# EAGLE design OSO-MISC-20-002 Analog Sensors (EAGLE 9.4.2)
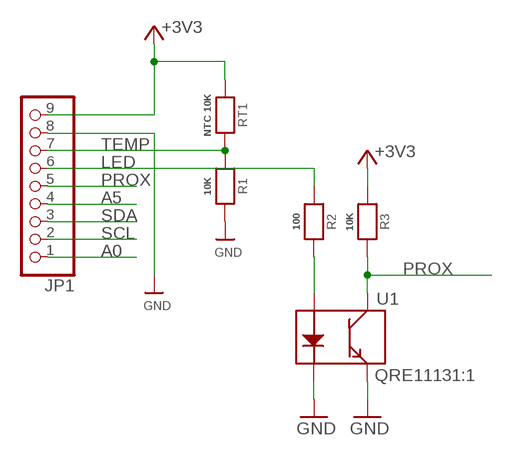
[diagram p0: schematic, sheet 1]

## Parts
JP1  HEADER-1X9_JSTSH  [JST_SH9]
R1  10K  RESISTOR0805_NOOUTLINE  [0805-NO]
R2  100  RESISTOR0805_NOOUTLINE  [0805-NO]
R3  10K  RESISTOR0805_NOOUTLINE  [0805-NO]
RT1  NTC 10K  RESISTOR0805_NOOUTLINE  [0805-NO]
U1  QRE11131:1  [QRE1113-1:1]

## Nets
+3V3: JP1.9 R3.1 RT1.1
A0: JP1.1
A5: JP1.4
GND [gnd]: JP1.8 R1.2 U1.2(K) U1.4(E)
LED: JP1.6 R2.1
N$1: R2.2 U1.1(A)
PROX: JP1.5 R3.2 U1.3(C)
SCL: JP1.2
SDA: JP1.3
TEMP: JP1.7 R1.1 RT1.2

## Library data of the parts
JP1 = microbuilder:HEADER-1X9: PIN HEADER
R1-R3 RT1 = microbuilder:RESISTOR: Resistors For new designs, use the packages preceded by an '_' character since they are more reliable: The following footprints should be used on most boards: _0402 - Standard footprint for regular board layouts _0603 - Standard footprint for regular board layouts _0805 - Standard footprint for regular board layouts _1206 - Standard footprint for regular board layouts For extremely tight-pitch boards where space is at a premium, the following 'micro-pitch' footprints can be used (smaller pads, no silkscreen outline, etc.): _0402MP - Micro-pitch footprint for very dense/compact boards _0603MP - Micro-pitch footprint for very dense/compact boards _0805MP - Micro-pitch footprint for very dense/compact boards _1206MP - Micro-pitch footprint for very dense/compact boards
U1 = Testing:QRE1113

## Net classes
0 default: width 0.152 mm, drill 0.254 mm

## Board
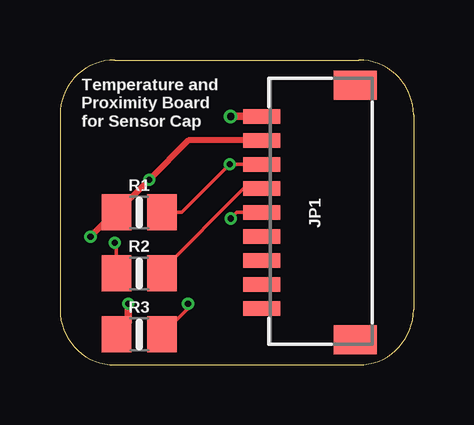
[diagram p1: board, top side]
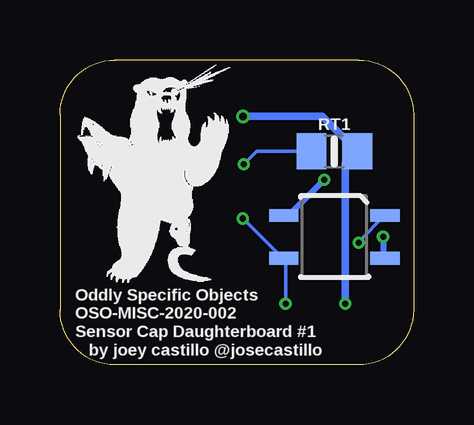
[diagram p2: board, bottom side, seen from below]

Size 14.73 x 12.7 mm. Coordinates in mm from the lower left corner, seen from the top.
Outline: 14.73,10.41 arc90 12.45,12.7 2.29,12.7 arc90 0,10.41 0,2.29 arc90 2.29,0 12.45,0 arc90 14.73,2.29 14.73,10.41
Copper layers (1*16): Top 0.035559375mm / dielectric 1.6mm / Bottom 0.035559375mm
Design rules "oshpark-2layer *": minimum track width 6mil, minimum drill 10mil, track to track 6mil, track to pad 6mil, pad to pad 6mil, via to via 6mil, smd to smd 6mil, copper to edge 15mil, drill to drill 6mil, minimum pad ring 5mil, minimum via ring 5mil, stop-mask expansion 2.5mil, vias tented up to drill 12mil, thermal gap 10mil

### Footprints (pad centres in the part's own frame; a part is rotated, then mirrored left to right if it is on the bottom)
JST_SH9 = smd 0.6 x 1.55: 1 -4,2.514; 2 -3,2.514; 3 -2,2.514; 4 -1,2.514; 5 0,2.514; 6 1,2.514; 7 2,2.514; 8 3,2.514; 9 4,2.514 | smd 1.2 x 1.8: MT1 -5.3,-1.386; MT2 5.3,-1.386
0805-NO = smd 1.24 x 1.5: 1 -0.95,0; 2 0.95,0
QRE1113-1:1 = smd 1.219 x 0.533: 1 -2.108,-0.889; 2 2.108,-0.889; 3 2.108,0.889; 4 -2.108,0.889

### Placement (x,y rotation side)
JP1  10.92,6.35 90 top
R1  3.3,6.35 180 top
R2  3.3,3.81 180 top
R3  3.3,1.27 0 top
RT1  3.3,8.89 180 bottom
U1  3.3,5.33 180 bottom
U$2  [OSO_BEAR_250X360MIL_1000DPI]  10.79,8 0 bottom

### Tracks (layer width: path | path; a pad name or v marks a point on that pad's centre or on a via)
+3V3  (via drill 0.25, 0.3)
  Top 0.305: JP1.9 v7.11,10.35 | v2.85,2.54 2.85,1.76 R3.1
  Bottom 0.305: v7.11,10.35 3.81,10.35 RT1.1 2.85,8.4 v2.85,2.54
GND  (via drill 0.25)
  Top 0.254: JP1.8 5.35,9.35 v3.72,7.71 R1.2 2.29,6.35 v1.27,5.33
  Bottom 0.254: v1.27,5.33 1.27,4.52 U1.4 | U1.2 5.21,6.22 v3.72,7.71
LED
  Top 0.152: R2.1 4.25,3.94 7.67,7.35 JP1.6
N$1  (via drill 0.25)
  Top 0.152: v2.29,5.08 2.35,5.01 R2.2
  Bottom 0.152: U1.1 2.29,5.13 v2.29,5.08
PROX  (via drill 0.25)
  Top 0.152: JP1.5 7.37,6.35 v7.11,6.1 | R3.2 5.33,2.35 v5.33,2.54
  Bottom 0.152: v7.11,6.1 5.46,4.45 | 5.46,4.45 U1.3 | v5.33,2.54 5.33,4.32 5.46,4.45
TEMP  (via drill 0.25)
  Top 0.152: R1.1 5.08,6.35 v7.08,8.35 JP1.7
  Bottom 0.152: v7.08,8.35 6.54,8.89 RT1.2

### Text on the board
tPlace: Temperature and / Proximity Board / for Sensor Cap
bPlace: Oddly Specific Objects / OSO-MISC-2020-002 / Sensor Cap Daughterboard #1 / by joey castillo @josecastillo